# EAGLE design PI CONTROLER (EAGLE 7.6.0)
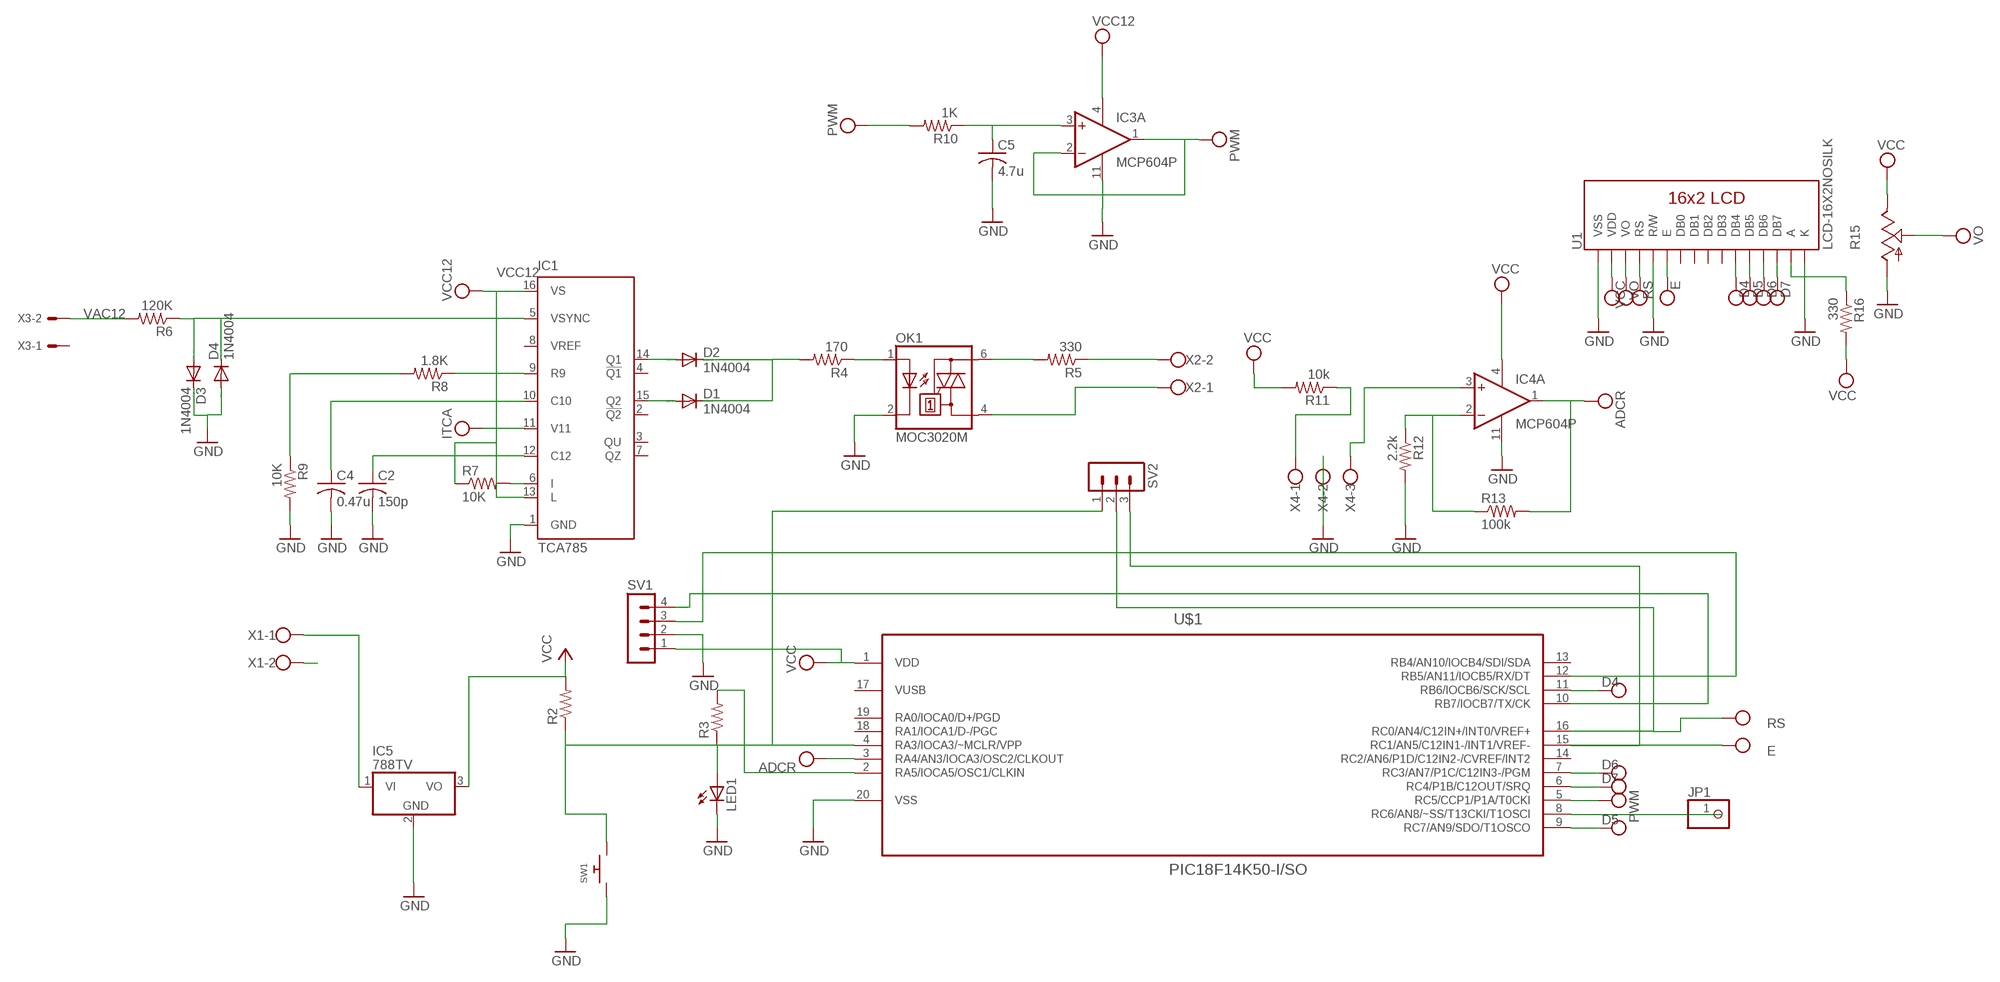
[diagram p0: schematic, sheet 1]

## Parts
C2  150p  C-US025-025X050  [C025-025X050]
C4  0.47u  C-US050-025X075  [C050-025X075]
C5  4.7u  C-US050-025X075  [C050-025X075]
D1  1N4004  [DO41-10]
D2  1N4004  [DO41-10]
D3  1N4004  [DO41-10]
D4  1N4004  [DO41-10]
IC1  TCA785  [DIL16]
IC3  MCP604P  [DIL14]
IC4  MCP604P  [DIL14]
IC5  788TV  [TO220V]
JP1  PINHD-1X1  [1X01]
LED1  LED5MM  [LED5MM]
OK1  MOC3020M  [DIL06]
R2  R-US_0207/10  [0207/10]
R3  R-US_0207/10  [0207/10]
R4  170  R-US_0207/10  [0207/10]
R5  330  R-US_0207/10  [0207/10]
R6  120K  R-US_0207/10  [0207/10]
R7  10K  R-US_0207/10  [0207/10]
R8  1.8K  R-US_0207/10  [0207/10]
R9  10K  R-US_0207/10  [0207/10]
R10  1K  R-US_0207/10  [0207/10]
R11  10k  R-US_0207/10  [0207/10]
R12  2.2k  R-US_0207/10  [0207/10]
R13  100k  R-US_0207/10  [0207/10]
R15  TRIM_US-RS3  [RS3]
R16  330  R-US_0207/10  [0207/10]
SV1  MA04-1  [MA04-1]
SV2  MA03-1  [MA03-1]
SW1  SWITCH_PUSHBUTTONEVQ-PE  [TACT_PANA-EVQ]
U1  LCD-16X2NOSILK  [LCD-16X2_NOSILK]
U$1  PIC18F14K50-I/SO  [SOIC127P1030X265-20N]
X1  W237-102  [W237-102]
X2  W237-102  [W237-102]
X3  KK-156-2  [KK-156-2]
X4  W237-103  [W237-103]

## Nets
ADCR: IC4.1(A:OUT) R13.2 U$1.3(RA4/AN3/IOCA3/OSC2/CLKOUT)
D4: U1.11(DB4) U$1.11(RB6/IOCB6/SCK/SCL)
D5: U1.12(DB5) U$1.9(RC7/AN9/SDO/T1OSCO)
D6: U1.13(DB6) U$1.7(RC3/AN7/P1C/C12IN3-/PGM)
D7: U1.14(DB7) U$1.6(RC4/P1B/C12OUT/SRQ)
D/: IC4.4(P:V+) IC5.3(VO) R2.2 R11.2 R15.E R16.2 SV1.1 U1.2(VDD) U$1.1(VDD) ; supply symbol labelled VCC
E: SV2.3 U1.6(E) U$1.15(RC1/AN5/C12IN1-/INT1/VREF-)
GND: C2.2 C4.2 C5.2 D3.C D4.A IC1.1(GND) IC3.11(P:V-) IC4.11(P:V-) IC5.2(GND) LED1.K(C) OK1.2(C) R9.2 R12.2 R15.A SV1.2 SW1.P$1 U1.1(VSS) U1.5(R/W) U1.16(K) U$1.20(VSS) X1.2 X4.2
ITCA: IC1.11(V11) IC3.1(A:OUT) IC3.2(A:-IN) ; supply symbol labelled PWM
N$1: R2.1 SV2.1 SW1.P$2 U$1.4(RA3/IOCA3/~MCLR/VPP)
N$2: R3.2 U$1.2(RA5/IOCA5/OSC1/CLKIN)
N$3: C2.1 IC1.12(C12)
N$5: SV1.4 U$1.10(RB7/IOCB7/TX/CK)
N$6: C4.1 IC1.10(C10)
N$9: D2.A IC1.14(Q1)
N$50: LED1.A R3.1
N$55: JP1.1 U$1.8(RC6/AN8/~SS/T13CKI/T1OSCI)
N$58: R5.1 X2.2
N$59: D1.A IC1.15(Q2)
N$60: D1.C D2.C R4.2
N$61: OK1.1(A) R4.1
N$62: OK1.6(A2) R5.2
N$63: OK1.4(A1) X2.1
N$64: D3.A D4.C IC1.5(VSYNC) R6.1
N$65: IC1.6(I) R7.2
N$66: IC1.9(R9) R8.1
N$67: R8.2 R9.1
N$68: C5.1 IC3.3(A:+IN) R10.1
N$69: R11.1 X4.1
N$70: IC4.3(A:+IN) X4.3
N$71: IC4.2(A:-IN) R12.1 R13.1
N$72: R16.1 U1.15(A)
N$78: SV1.3 U$1.12(RB5/AN11/IOCB5/RX/DT)
PWM: R10.2 U$1.5(RC5/CCP1/P1A/T0CKI)
RS: SV2.2 U1.4(RS) U$1.16(RC0/AN4/C12IN+/INT0/VREF+)
VAC12: R6.2 X3.2
VCC12: IC1.13(L) IC1.16(VS) IC3.4(P:V+) IC5.1(VI) R7.1 X1.1
VO: R15.S U1.3(VO)
Unconnected: IC1.2(!Q2) IC1.3(QU) IC1.4(!Q1) IC1.7(QZ) IC1.8(VREF) IC3.5(B:+IN) IC3.6(B:-IN) IC3.7(B:OUT) IC3.8(C:OUT) IC3.9(C:-IN) IC3.10(C:+IN) IC3.12(D:+IN) IC3.13(D:-IN) IC3.14(D:OUT) IC4.5(B:+IN) IC4.6(B:-IN) IC4.7(B:OUT) IC4.8(C:OUT) IC4.9(C:-IN) IC4.10(C:+IN) IC4.12(D:+IN) IC4.13(D:-IN) IC4.14(D:OUT) U1.7(DB0) U1.8(DB1) U1.9(DB2) U1.10(DB3) U$1.13(RB4/AN10/IOCB4/SDI/SDA) U$1.14(RC2/AN6/P1D/C12IN2-/CVREF/INT2) U$1.17(VUSB) U$1.18(RA1/IOCA1/D-/PGC) U$1.19(RA0/IOCA0/D+/PGD) X3.1

## Library data of the parts
C2 = adafruit:C-US: CAPACITOR, American symbol
C4 C5 = resistor:C-US: CAPACITOR, American symbol
D1-D4 = diode:1N4004: DIODE general purpose rectifier, 1 A
IC1 = infineon:TCA785: Phase Control IC Source: http://www.infineon.com/ .. tca785.pdf; OC_FARNELL: unknown; OC_NEWARK: unknown
IC3 IC4 = linear:MCP604: Quad Op Amp 2.7V to 6.0V Single Supply CMOS Source: http://ww1.microchip.com/downloads/en/DeviceDoc/21314g.pdf
IC5 = linear:78*: Positive VOLTAGE REGULATOR Source: http://cache.national.com/ds/LM/LM78L05.pdf http://www.fairchildsemi.com/ds/LM/LM7805.pdf
JP1 = adafruit:PINHD-1X1: Pin header 1x1 for 0.1" spacing With round pins
LED1 = adafruit:LED: LED OSRAM: - CHIPLED LG R971, LG N971, LY N971, LG Q971, LY Q971, LO R971, LY R971 LH N974, LH R974 LS Q976, LO Q976, LY Q976 LO Q996 - Hyper CHIPLED LW Q18S LB Q993, LB Q99A, LB R99A - SideLED LS A670, LO A670, LY A670, LG A670, LP A670 LB A673, LV A673, LT A673, LW A673 LH A674 LY A675 LS A676, LA A676, LO A676, LY A676, LW A676 LS A679, LY A679, LG A679 - Hyper Micro SIDELED® LS Y876, LA Y876, LO Y876, LY Y876 LT Y87S - SmartLED LW L88C, LW L88S LB L89C, LB L89S, LG L890 LS L89K, LO L89K, LY L89K LS L896, LA L896, LO L896, LY L896 - TOPLED LS T670, LO T670, LY T670, LG T670, LP T670 LSG T670, LSP T670, LSY T670, LOP T670, LYG T670 LG T671, LOG T671, LSG T671 LB T673, LV T673, LT T673, LW T673 LH T674 LS T676, LA T676, LO T676, LY T676, LB T676, LH T676, LSB T676, LW T676 LB T67C, LV T67C, LT T67C, LS T67K, LO T67K, LY T67K, LW E67C LS E67B, LA E67B, LO E67B, LY E67B, LB E67C, LV E67C, LT E67C LW T67C LS T679, LY T679, LG T679 LS T770, LO T770, LY T770, LG T770, LP T770 LB T773, LV T773, LT T773, LW T773 LH T774 LS E675, LA E675, LY E675, LS T675 LS T776, LA T776, LO T776, LY T776, LB T776 LHGB T686 LT T68C, LB T68C - Hyper Mini TOPLED® LB M676 - Mini TOPLED Santana® LG M470 LS M47K, LO M47K, LY M47K Source: http://www.osram.convergy.de/
OK1 = optocoupler:MOC30*M: RANDOM-PHASE OPTOISOLATORS TRIAC DRIVER OUTPUT Source: http://www.fairchildsemi.com MOC3020-M.pdf; MF: FAIRCHILD SEMICONDUCTOR; MPN: MOC3020-M; OC_FARNELL: 1505425; OC_NEWARK: 72K8895
R2-R13 R16 = resistor:R-US_: RESISTOR, American symbol
R15 = pot:TRIM_US-: POTENTIOMETER
SV1 = con-lstb:MA04-1: PIN HEADER; OC_FARNELL: unknown; OC_NEWARK: unknown
SV2 = con-lstb:MA03-1: PIN HEADER; OC_FARNELL: unknown; OC_NEWARK: unknown
SW1 = adafruit:SWITCH_PUSHBUTTON: Buttons SOFTTOUCHSMD_SJ - Soft touch temporary push button (Super Junk Akihabara) Compatible with SKPMANE010 [Mouser: 688-SKPMAN] C&K_KSS = Digikey: KSS221GLFS
U1 = SparkFun-Displays:LCD-16X2: Standard text-only 16x2 parallel input LCD
U$1 = Microchip_By_element14_Batch_1:PIC18F14K50-I/SO: USB Flash Microcontrollers; DESCRIPTION: Microcontrollers; MPN: PIC18F14K50-I/SO; OC_FARNELL: 1648502; OC_NEWARK: 77M3104; PACKAGE: SOIC-20; SUPPLIER: Microchip
X1 X2 = con-wago-500:W237-102: WAGO SCREW CLAMP; MPN: 237-102; OC_FARNELL: unknown; OC_NEWARK: 70K9898
X3 = con-molex:KK-156-2: KK 156 HEADER Source: http://www.molex.com/pdm_docs/sd/026604100_sd.pdf; OC_FARNELL: unknown; OC_NEWARK: unknown
X4 = con-wago-500:W237-103: WAGO SCREW CLAMP; MPN: 237-103; OC_FARNELL: unknown; OC_NEWARK: 18M7116

## Board
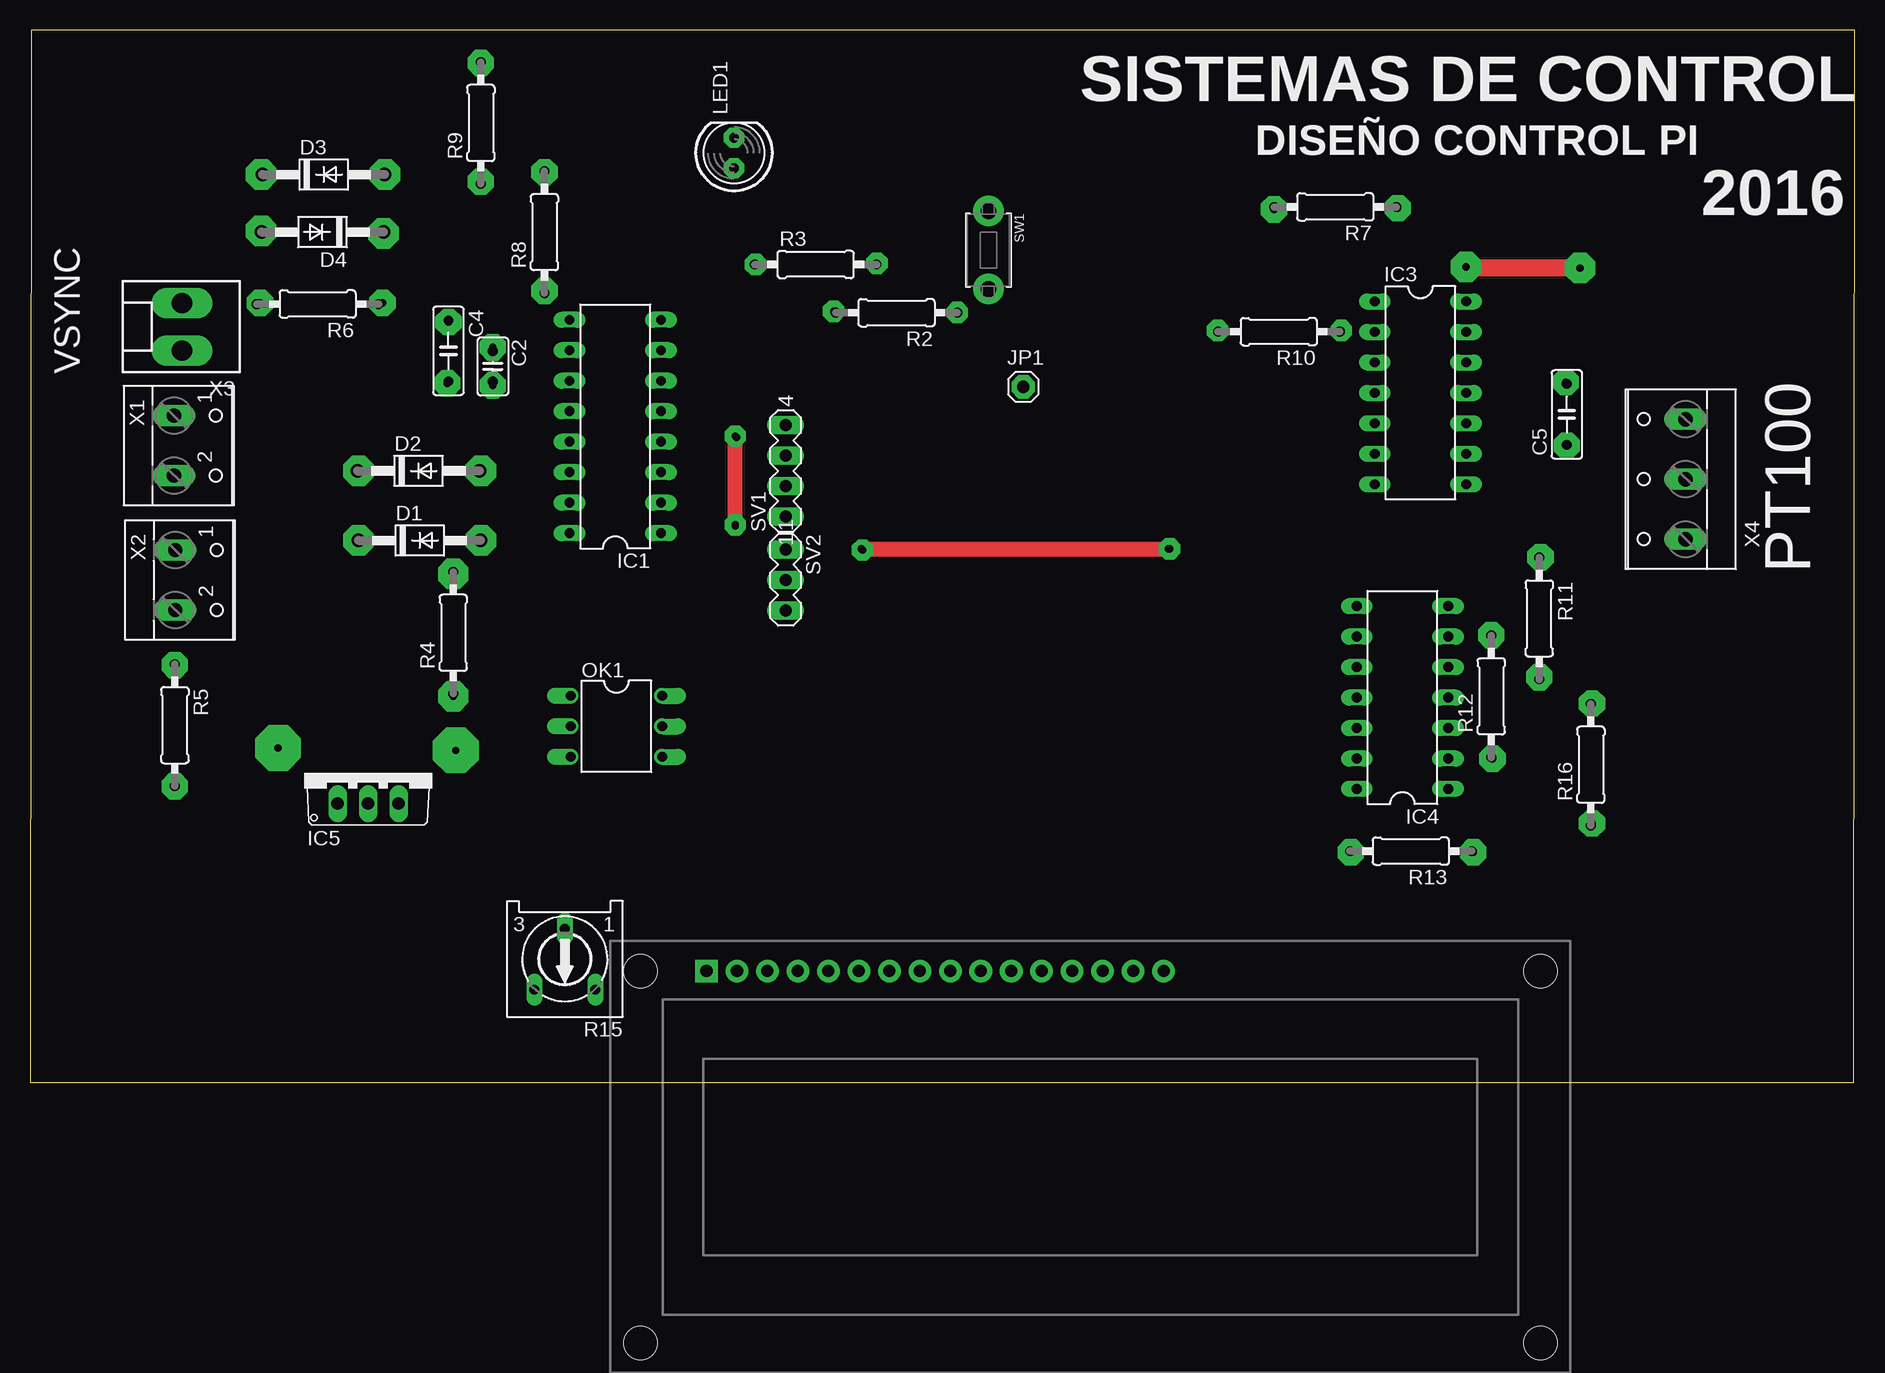
[diagram p1: board, top side]
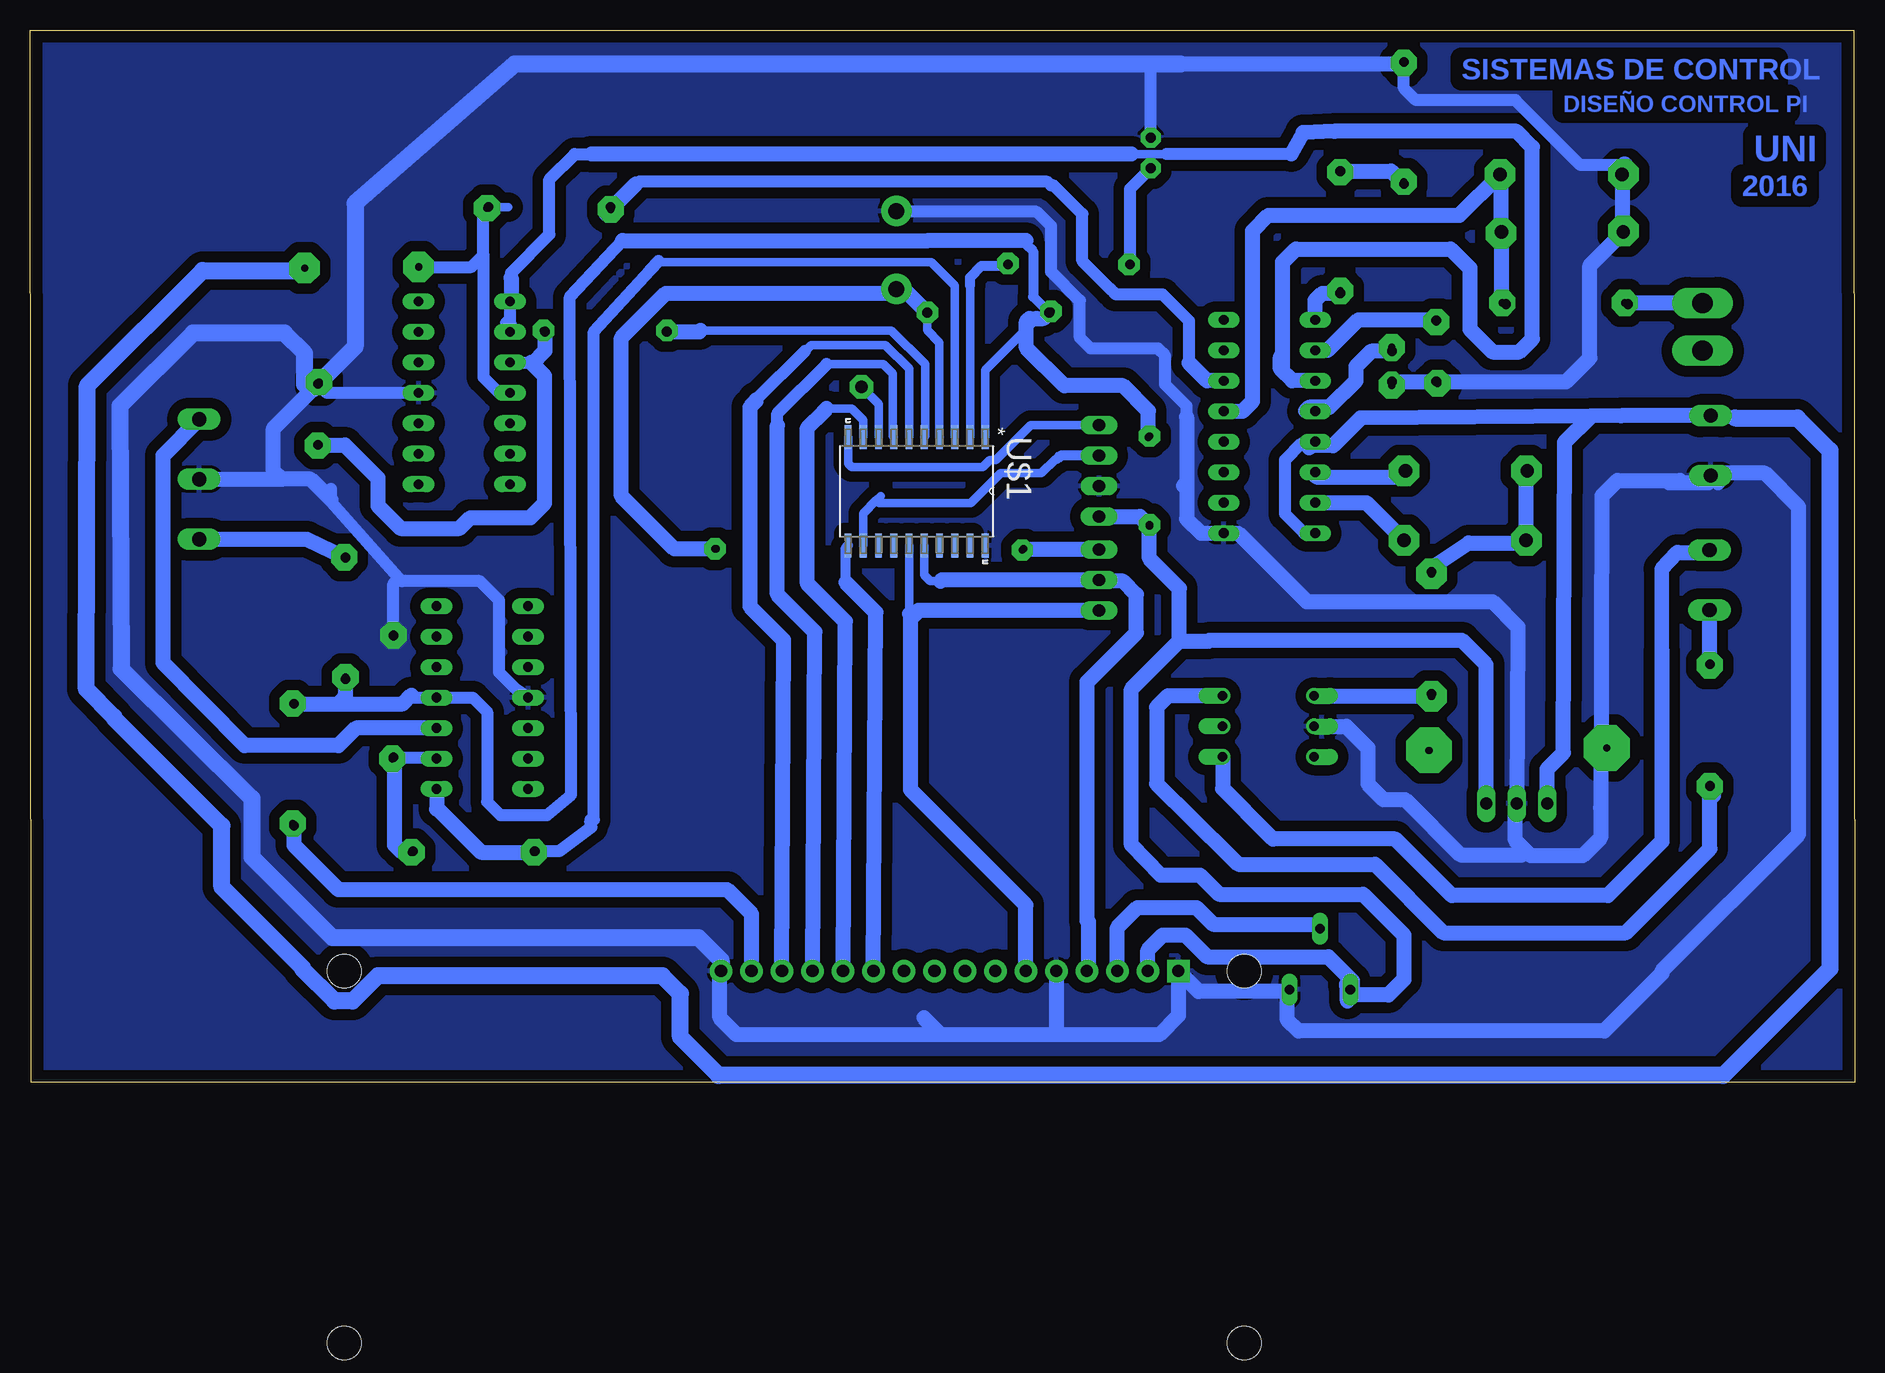
[diagram p2: board, bottom side, seen from below]

Size 152.06 x 87.73 mm. Coordinates in mm from the lower left corner, seen from the top.
Outline: 0,0 151.96,0 152.06,87.73 0.1,87.73 0,0
Copper layers (1*16): Top 0.035mm / dielectric 1.5mm / Bottom 0.035mm
Design rules "default *": minimum track width 10mil, minimum drill 24mil, track to track 35mil, track to pad 30mil, pad to pad 30mil, via to via 30mil, smd to smd 30mil, copper to edge 40mil, drill to drill 8mil, minimum pad ring 10mil, minimum via ring 8mil, stop-mask expansion 4mil, vias tented up to drill 0mil, thermal gap 10mil

### Footprints (pad centres in the part's own frame; a part is rotated, then mirrored left to right if it is on the bottom)
C025-025X050 = drill 0.813 pad 1.676 octagon: 1 -1.27,0; 2 1.27,0
C050-025X075 = drill 0.813 octagon: 1 -2.54,0; 2 2.54,0
DO41-10 = drill 1.118: A 5.08,0; C -5.08,0
DIL16 = drill 0.813 long: 1 -8.89,-3.81; 2 -6.35,-3.81; 3 -3.81,-3.81; 4 -1.27,-3.81; 5 1.27,-3.81; 6 3.81,-3.81; 7 6.35,-3.81; 8 8.89,-3.81; 9 8.89,3.81; 10 6.35,3.81; 11 3.81,3.81; 12 1.27,3.81; 13 -1.27,3.81; 14 -3.81,3.81; 15 -6.35,3.81; 16 -8.89,3.81
DIL14 = drill 0.813 long: 1 -7.62,-3.81; 2 -5.08,-3.81; 3 -2.54,-3.81; 4 0,-3.81; 5 2.54,-3.81; 6 5.08,-3.81; 7 7.62,-3.81; 8 7.62,3.81; 9 5.08,3.81; 10 2.54,3.81; 11 0,3.81; 12 -2.54,3.81; 13 -5.08,3.81; 14 -7.62,3.81
TO220V = drill 1.016 long: 1 -2.54,-2.54; 2 0,-2.54; 3 2.54,-2.54
1X01 = drill 1.016 pad 1.93 octagon: 1 0,0
LED5MM = drill 0.813 pad 1.676 octagon: A -1.27,0; K 1.27,0
DIL06 = drill 0.813 offset: 1 -2.54,-3.81; 2 0,-3.81; 3 2.54,-3.81; 4 2.54,3.81; 5 0,3.81; 6 -2.54,3.81
0207/10 = drill 0.813 octagon: 1 -5.08,0; 2 5.08,0
RS3 = drill 0.813 long: A -2.54,2.54; E 2.54,2.54; S 0,-2.54
MA04-1 = drill 1.016 long: 1 -3.81,0; 2 -1.27,0; 3 1.27,0; 4 3.81,0
MA03-1 = drill 1.016 long: 1 -2.54,0; 2 0,0; 3 2.54,0
TACT_PANA-EVQ = drill 1.3 pad 2.54: P$1 -3.25,0; P$2 3.25,0
LCD-16X2_NOSILK = drill 1.016 pad 1.88 square: 1 -32,15.5 | drill 1.016 pad 1.88: 2 -29.46,15.5; 3 -26.92,15.5; 4 -24.38,15.5; 5 -21.84,15.5; 6 -19.3,15.5; 7 -16.76,15.5; 8 -14.22,15.5; 9 -11.68,15.5; 10 -9.14,15.5; 11 -6.6,15.5; 12 -4.06,15.5; 13 -1.52,15.5; 14 1.02,15.5; 15 3.56,15.5; 16 6.1,15.5 | hole 2.8: -37.5,15.5; -37.5,-15.5; 37.5,15.5; 37.5,-15.5
SOIC127P1030X265-20N = smd 1.981 x 0.559: 1 -4.521,5.715; 2 -4.521,4.445; 3 -4.521,3.175; 4 -4.521,1.905; 5 -4.521,0.635; 6 -4.521,-0.635; 7 -4.521,-1.905; 8 -4.521,-3.175; 9 -4.521,-4.445; 10 -4.521,-5.715; 11 4.521,-5.715; 12 4.521,-4.445; 13 4.521,-3.175; 14 4.521,-1.905; 15 4.521,-0.635; 16 4.521,0.635; 17 4.521,1.905; 18 4.521,3.175; 19 4.521,4.445; 20 4.521,5.715
W237-102 = drill 1.194 long: 1 -2.5,-1.27; 2 2.5,-1.27
KK-156-2 = drill 1.7 pad 2.184 long: 1 -1.98,0; 2 1.98,0
W237-103 = drill 1.194 long: 1 -5,-1.29; 2 0,-1.29; 3 5,-1.29

### Placement (x,y rotation side)
C2  38.57,59.68 270 top
C4  34.87,60.98 270 top
C5  128.07,55.68 90 top
D1  32.47,45.18 0 top
D2  32.37,50.98 0 top
D3  24.47,75.68 0 top
D4  24.37,70.88 180 top
IC1  48.77,54.68 90 top
IC3  115.87,57.48 270 top
IC4  114.37,32.08 90 top
IC5  28.17,25.78 0 top
JP1  82.77,57.98 0 top
LED1  58.67,77.48 90 top
OK1  48.87,29.68 270 top
R2  72.21,64.16 180 top
R3  65.47,68.18 0 top
R4  35.27,37.48 90 top
R5  12.07,29.78 270 top
R6  23.97,64.88 180 top
R7  108.77,72.98 180 top
R8  42.87,70.88 90 top
R9  37.57,79.98 90 top
R10  104.07,62.58 180 top
R11  125.77,38.68 270 top
R12  121.77,32.18 90 top
R13  115.07,19.28 180 top
R15  44.57,10.28 180 top
R16  130.07,26.48 90 top
SV1  62.97,50.98 90 top
SV2  62.97,41.88 270 top
SW1  79.87,69.38 270 top
U1  88.37,-6.22 0 top
U$1  78.17,49.28 270 bottom
X1  13.27,53.08 270 top
X2  13.37,41.88 270 top
X3  12.67,62.98 90 top
X4  136.67,50.28 90 top

### Tracks (layer width: path | path; a pad name or v marks a point on that pad's centre or on a via)
ADCR
  Bottom 0.7: U$1.3 75,66.41 76.97,68.38 99.71,68.38 100.33,67.75
  Bottom 1.016: R13.2 107.97,19.28 105.27,21.28 105.37,21.88 105.07,21.88 105.07,62.58 100.33,67.75 99.67,68.48
  Bottom 1.27: IC4.1 118.18,22.79 118.08,22.79 114.47,19.18 110.09,19.18 R13.2
D4
  Bottom 0.813: 84.07,41.68 84.07,44.57 U$1.11
  Bottom 1.27: U1.11 81.57,39.18 84.07,41.68
D5
  Bottom 0.7: U$1.9 82.61,55.23 83.57,56.18 85.67,56.18
  Bottom 1.27: U1.12 84.11,38.42 87.27,41.58 87.27,54.58 85.92,55.93 85.67,56.18
D6
  Bottom 0.7: 85.67,59.88 80.97,59.88 80.17,59.08 80.17,53.9 U$1.7
  Bottom 1.016: 89.77,54.78 89.77,55.78 85.67,59.88
  Bottom 1.27: U1.13 86.65,37.56 89.77,40.68 89.77,54.78
D7
  Bottom 0.7: U$1.6 78.81,59.52 80.77,61.48 86.97,61.48 87.47,60.98
  Bottom 1.016: 87.47,60.98 91.57,56.88
  Bottom 1.27: 91.57,56.88 91.57,56.78 92.07,56.28 92.07,39.68 89.27,36.88 89.47,9.36 U1.14
D/  (via drill 0.6, 0.6 pad 1.78)
  Top 1.27: v58.77,46.38 v58.77,46.48 58.77,53.68 v58.87,53.78
  Bottom 0.7: U$1.1 72.45,59.39 68.17,63.68 | 68.87,70.19 69.06,70.19 | R2.2 66.69,64.16 66.57,64.28
  Bottom 0.813: 69.06,70.19 69.06,69.87 68.47,69.28 68.47,65.5 R2.2
  Bottom 1.016: 120.27,32.28 120.07,32.08 IC4.4 115.17,32.08 113.97,30.88 113.97,23.38 112.87,22.28 108.97,22.28 106.97,23.98 107.07,65.48 102.67,70.18
  Bottom 1.27: U1.2 58.91,11.04 57.67,12.28 55.77,12.28 53.97,10.48 43.87,10.48 41.87,8.48 41.87,7.9 R15.E 42.37,8.08 42.37,8.18 42.27,8.08 42.27,6.78 41.77,7.28 38.87,7.28 37.57,8.58 37.57,12.28 40.97,15.68 52.97,15.68 54.57,17.28 57.87,17.28 60.27,19.78 60.27,32.78 56.27,36.78 | 69.06,70.19 77.17,70.18 102.67,70.18 | R16.2 126.37,31.56 | 126.37,31.56 120.99,31.56 120.27,32.28 | R11.2 125.77,32.28 125.87,32.18 125.87,32.06 126.37,31.56 | 56.27,36.78 53.85,36.78 53.77,36.87 32.76,36.87 30.71,34.82 IC5.3 | SV1.1 59.57,47.18 v58.77,46.38 58.77,43.68 56.27,41.18 56.27,36.78 | v58.87,53.78 58.87,55.98 60.97,58.08 65.87,58.08 69.02,61.23 69.02,63.43 68.77,63.68 68.17,63.68 67.61,63.68 R2.2
E
  Bottom 0.7: 78.77,39.08 78.77,44.72 U$1.15
  Bottom 1.27: U1.6 69.07,14.78 78.67,24.38 78.67,38.68 | 78.67,38.68 78.67,38.98 78.77,39.08 | SV2.3 78.01,39.34 78.67,38.68
GND  (via drill 0.6 pad 2.18)
  Bottom 1.016: IC3.11 127.33,57.48 C5.2 128.11,58.18 129.17,58.18 | IC4.11 111.57,32.78 112.97,34.18 112.97,40.18 114.57,41.78 121.07,41.78 121.32,42.03 | 121.32,42.03 126.97,48.38 126.97,48.58 126.97,49.48 | R12.2 v121.77,37.28 121.77,41.58 121.32,42.03 | 19.17,76.48 22.87,76.48 28.27,81.88 36.57,81.88 37.57,82.88 37.57,84.48 37.47,84.58 | SW1.P$1 79.82,72.58 68.17,72.58 66.97,71.38 66.97,67.58 64.57,65.18 64.57,62.08 63.67,61.18 58.07,61.18 57.47,60.58 57.47,58.18 55.67,56.38 55.67,55.48 | LED1.K 58.67,84.78 58.77,84.88
  Bottom 1.27: D3.C 19.39,75.18 | 19.39,75.18 19.39,70.98 D4.A 22.07,68.1 22.07,60.38 24.04,58.41 34.9,58.41 | 12.57,50.38 12.17,49.98 14.37,49.98 | 12.57,50.38 12.2,50.38 X1.2 11.4,49.98 | 28.07,23.14 IC5.2 | 14.37,49.98 15.47,49.98 | 19.17,76.28 19.17,75.4 19.39,75.18 | 12.57,50.38 12.17,50.78 7.47,50.78 4.67,47.98 4.67,20.68 16.07,9.28 16.07,9.08 20.87,4.28 46.37,4.28 47.27,5.18 47.27,7.58 | 47.27,7.58 R15.A | 47.27,7.58 54.67,7.58 U1.1 56.37,5.58 57.97,3.98 66.77,3.98 | 66.77,3.98 76.17,3.98 | 76.17,3.98 93.17,3.98 94.57,5.38 94.57,9.18 U1.16 | U1.5 66.53,4.22 66.77,3.98 | 77.57,5.38 76.17,3.98 | R9.2 37.47,84.96 37.47,84.58 37.77,84.88 56.2,84.88 | C2.2 34.9,58.41 | 34.9,58.41 C4.2 | IC5.2 28.07,37.98 30.17,40.08 45.67,40.08 51.38,45.79 IC1.1 54.47,45.78 55.67,46.98 55.67,49.98 | X4.2 131.07,50.28 | 126.97,48.58 128.67,50.28 131.07,50.28 | 131.07,50.28 131.77,50.98 131.77,54.52 128.49,57.8 C5.2 | 14.37,49.98 14.57,50.18 19.77,50.18 21.07,48.88 21.17,22.88 21.17,20.38 22.67,18.88 26.97,18.88 27.27,19.18 | 55.67,55.48 55.67,49.98 | 55.94,49.71 55.67,49.98 | 27.27,19.18 28.27,20.18 28.27,23.14 IC5.2 | OK1.2 42.37,29.68 40.57,27.88 40.57,24.88 39.27,23.58 37.47,23.58 32.87,18.98 27.67,18.98 27.27,19.18
  Bottom 1.422: 129.17,58.18 129.17,60.78 130.87,62.48 138.47,62.48 144.57,56.38 144.47,34.48 133.57,23.68 133.57,18.78 126.87,12.08 96.37,12.08 94.47,10.18 U1.16 | 56.2,84.88 58.77,84.88 111.67,84.88 124.97,73.28 124.97,61.32 128.49,57.8 | 19.17,76.28 19.17,76.48
  pour Bottom: 0.1,87.76 -0.1,-0.6 152.68,-0.3 152.88,88.06
ITCA
  Bottom 0.7: 57.37,77.38 60.27,77.38
  Bottom 1.016: IC3.2 IC3.1 | 111.97,67.08 111.97,67.48 108.77,70.68 108.77,75.28 106.67,77.38 105.27,77.38 104.37,77.38 | 46.97,77.38 57.37,77.38
  Bottom 1.2: 45.97,79.18 46.97,77.38
  Bottom 1.27: IC1.11 46.88,58.49 47.87,59.48 47.87,60.48 47.67,60.68 | 47.67,59.48 47.67,60.68 | 47.67,60.68 47.67,68.38 46.57,69.48 33.67,69.48 32.07,67.88 32.07,62.78 30.17,60.88 27.97,60.88 26.87,61.98 26.87,77.98 28.17,79.28 43.37,79.28 45.97,79.18 | 111.97,67.08 111.97,65.19 IC3.1 | IC3.2 112.06,63.07 112.07,63.08 | 112.27,63.28 112.07,63.08 | 112.07,63.08 112.17,63.08 | 60.27,77.38 105.27,77.38
N$1  (via drill 0.6, 0.6 pad 1.78)
  Top 1.27: v69.27,44.48 v94.87,44.48
  Bottom 0.7: R2.1 77.29,62.7 76.27,61.68 U$1.4
  Bottom 1.27: R2.1 79.26,66.13 SW1.P$2 80.22,65.78 99.07,65.78 102.77,62.08 102.77,48.88 98.37,44.48 v94.97,44.48 v94.87,44.48 | SV2.1 69.21,44.42 v69.27,44.48
N$2
  Bottom 0.7: U$1.2 73.72,66.44
  Bottom 0.813: 73.72,66.44 73.72,67.12 72.77,68.08 70.65,68.08 R3.2
N$3
  Bottom 1.27: IC1.12 44.99,55.98 45.77,55.98 45.47,56.28 43.77,56.28 41.57,58.48 41.57,59.68 40.3,60.95 C2.1
N$4  (via drill 0.6 pad 2.54)
  other vias: 19.27,75.68
N$5
  Bottom 0.7: U$1.10 83.88,51.59 83.57,51.28 72.67,51.28 72.07,51.88 71.57,51.88 68.67,54.78 SV1.4
N$6
  Bottom 1.27: IC1.10 43.92,61.03 41.37,63.58 34.93,63.58 C4.1
N$7  (via drill 0.6 pad 2.54)
  other vias: 29.57,75.68
N$8  (via drill 0.6 pad 2.54)
  other vias: 19.27,70.98
N$9
  Bottom 1.27: IC1.14 44.96,50.57 44.87,50.48 37.95,50.48 D2.A
N$10  (via drill 0.6 pad 2.54)
  other vias: 29.47,70.78
N$11  (via drill 0.6 pad 2.54)
  other vias: 27.37,45.18
N$12  (via drill 0.6 pad 2.54)
  other vias: 27.37,50.98
N$13  (via drill 0.6 pad 2.54)
  other vias: 37.57,50.98
N$14  (via drill 0.6 pad 2.54)
  other vias: 37.57,45.18
N$15  (via drill 0.6 pad 2.54)
  other vias: 35.27,42.38
N$16  (via drill 0.6 pad 2.54)
  other vias: 35.27,32.18
N$18  (via drill 0.6 pad 1.78)
  other vias: 58.77,53.88
N$24
  pour Bottom: -0.03,87.98 -0.23,-0.42 152.17,0.08 152.37,88.48
N$27  (via drill 0.6 pad 2.18)
  other vias: 125.87,43.78
N$28  (via drill 0.6 pad 2.18)
  other vias: 121.87,26.98
N$29  (via drill 0.6 pad 2.18)
  other vias: 120.27,19.18
N$30  (via drill 0.6 pad 2.18)
  other vias: 110.07,19.18
N$31  (via drill 0.6 pad 2.18)
  other vias: 130.17,21.58
N$32  (via drill 0.6 pad 2.18)
  other vias: 130.17,31.58
N$35  (via drill 0.6 pad 2.18)
  other vias: 125.77,33.78
N$36  (via drill 0.6 pad 2.18)
  other vias: 127.97,58.38
N$37  (via drill 0.6 pad 2.18)
  other vias: 128.07,53.08
N$40  (via drill 0.6 pad 2.18)
  other vias: 103.67,72.78
N$41  (via drill 0.6 pad 2.18)
  other vias: 113.97,72.88
N$42  (via drill 0.6 pad 2.18)
  other vias: 37.57,75.08
N$43  (via drill 0.6 pad 2.18)
  other vias: 37.57,84.98
N$44  (via drill 0.6 pad 2.18)
  other vias: 29.37,64.98
N$45  (via drill 0.6 pad 2.18)
  other vias: 19.17,64.98
N$46  (via drill 0.6 pad 2.18)
  other vias: 12.07,34.78
N$47  (via drill 0.6 pad 2.18)
  other vias: 12.07,24.68
N$48  (via drill 0.6 pad 2.18)
  other vias: 34.87,63.38
N$49  (via drill 0.6 pad 2.18)
  other vias: 34.77,58.28
N$50
  Bottom 1.016: R3.1 60.39,74.49 LED1.A
N$51  (via drill 0.6 pad 2.18)
  other vias: 38.57,61.28
N$52  (via drill 0.6 pad 2.18)
  other vias: 38.57,58.08
N$53  (via drill 0.6 pad 2.18)
  other vias: 42.87,75.88
N$54  (via drill 0.6 pad 2.18)
  other vias: 42.87,65.98
N$55
  Bottom 0.7: U$1.8 81.34,56.55 JP1.1
N$56  (via drill 0.6 pad 1.78)
  other vias: 69.37,44.38
N$58
  Bottom 1.27: R5.1 12.07,39.35 X2.2
N$59
  Bottom 1.27: IC1.15 40.7,48.33 D1.A
N$60
  Bottom 1.27: D2.C 27.39,50.88 D1.C 27.59,44.98 32.17,44.98 35.27,42.88 R4.2
N$61
  Bottom 1.27: OK1.1 35.45,32.22 R4.1
N$62
  Bottom 1.27: OK1.6 57.23,32.22 58.17,31.28 58.17,24.88 52.07,18.88 51.37,18.18 39.97,18.18 34.27,12.48 19.07,12.48 12.07,19.48 R5.2 11.77,24.4 11.77,23.88
N$63
  Bottom 1.2: 16.07,35.98 16.07,42.78
  Bottom 1.27: OK1.4 52.68,24.49 48.87,20.68 48.57,20.38 48.47,20.28 38.27,20.28 33.57,15.58 20.57,15.58 16.07,20.08 16.07,35.98 | 16.07,42.78 14.77,44.18 12.3,44.18 X2.1
N$64
  Bottom 1.27: 29.45,71.48 D4.C 29.45,65.28 R6.1 | 29.45,71.48 29.45,75.58 D3.A 32.95,72.28 48.87,72.28 50.17,70.98 50.17,56.78 51,55.95 IC1.5 | 30.05,70.88 29.45,71.48
N$65
  Bottom 1.016: 101.57,74.88 101.37,75.08 67.27,75.08 66.97,74.78 66.77,74.78 64.37,72.38 64.37,68.48 62.02,66.13 61.67,65.78 61.57,65.68 57.67,65.68 55.47,63.48 55.47,59.98
  Bottom 1.27: IC1.6 53.98,58.49 55.47,59.98 | 101.57,74.88 104.07,72.38 104.07,72.6 R7.2
N$66
  Bottom 1.27: IC1.9 44.96,65.19 44.37,65.78 42.89,65.78 R8.1
N$67
  Bottom 1.27: R8.2 38.63,75.96 R9.1
N$68
  Bottom 1.016: IC3.3 110.31,60.02
  Bottom 1.27: 110.22,59.93 109.17,58.88 109.17,48.28 110.37,47.08 115.37,47.08 116.27,46.18 121.17,46.18 123.07,48.08 123.07,50.38 125.83,53.14 C5.1 | 110.22,59.93 110.31,60.02 | R10.1 109.15,61 110.22,59.93
N$69
  Bottom 1.27: X4.1 128.99,45.28 R11.1
N$70
  Bottom 1.27: IC4.3 124.91,29.54 126.37,28.08 134.17,28.08 140.97,34.98 140.97,52.27 X4.3
N$71
  Bottom 1.016: R12.1 118.28,27.1 IC4.2
  Bottom 1.27: R13.1 121.17,19.28 121.67,19.78 121.67,27 R12.1
N$72
  Bottom 1.27: U1.15 91.93,14.04 93.97,16.08 126.37,16.08 130.07,19.78 R16.1
N$73  (via drill 0.6 pad 1.78)
  other vias: 98.97,62.68
N$75  (via drill 0.6 pad 1.78)
  other vias: 109.27,62.68
N$76  (via drill 0.6 pad 1.78)
  other vias: 66.97,64.28
N$77  (via drill 0.6 pad 1.78)
  other vias: 77.27,64.18
N$78
  Bottom 0.7: U$1.12 82.61,47.44 81.52,48.53 | 81.52,48.53 81.17,48.88 | 66.47,51.98 66.57,51.98 67.77,50.78 71.17,50.78 73.67,48.28 81.27,48.28 81.52,48.53
  Bottom 0.813: SV1.3 66.2,52.25 66.47,51.98
N$80  (via drill 0.6 pad 1.78)
  other vias: 60.47,68.18
N$81  (via drill 0.6 pad 1.78)
  other vias: 70.57,68.28
N$86  (via drill 0.6 pad 3.81)
  other vias: 35.47,27.68
N$87  (via drill 0.6 pad 3.81)
  other vias: 20.67,27.88
PWM
  Bottom 0.7: 96.37,62.68 96.17,62.68 80.27,62.68 77.47,59.88 77.47,53.87 U$1.5
  Bottom 1.27: R10.2 96.27,62.58 96.17,62.68
RS
  Bottom 0.7: U$1.16 77.53,42.28 77.03,41.78 76.17,41.78
  Bottom 1.27: U1.4 63.87,9.4 63.87,13.38 63.97,13.48 63.97,33.38 59.87,37.48 59.87,40.68 60.97,41.78 62.87,41.78 SV2.2 76.07,41.88 76.17,41.78
VAC12
  Bottom 1.27: X3.2 19.21,64.96 R6.2
VCC12  (via drill 0.6 pad 2.54)
  Top 1.422: v129.17,67.88 119.77,67.88 v119.67,67.98
  Bottom 0.7: R7.1 112.2,72.98
  Bottom 1.016: IC1.16 45.88,45.79 47.47,47.38 47.47,51.88 46.07,53.28 45.89,53.28 45.49,52.88 | 9.97,55.38 11.8,55.38 X1.1 | 114.27,68.98 114.27,58.78 113.07,57.58 112.16,57.58 IC3.4 | v119.67,67.98 115.27,67.98 114.27,68.98 | 114.27,68.98 114.27,72.56 R7.1
  Bottom 1.27: 45.49,52.88 45.29,53.08 | 45.29,53.08 IC1.13 | X1.1 19.47,55.58 21.97,55.56 | 21.97,55.56 41.17,55.38 43.47,53.08 45.29,53.08 | IC5.1 25.63,26.12 24.27,27.48 24.17,53.36 21.97,55.56
  Bottom 1.422: 9.97,55.38 4.77,55.38 2.07,52.68 2.07,9.48 10.97,0.58 94.67,0.58 97.87,3.78 97.87,7.38 99.37,8.88 123.07,8.88 125.17,6.78 126.67,6.78 129.37,9.48 129.37,9.58 136.07,16.28 136.07,21.38 145.07,30.38 145.07,30.48 147.37,32.78 147.27,58.08 137.67,67.68 129.37,67.68 v129.17,67.88
VO
  Bottom 1.27: U1.3 61.45,12.9 59.77,14.58 54.87,14.58 53.47,13.18 44.93,13.18 R15.S

### Text on the board
Bottom: SISTEMAS DE CONTROL | DISEÑO CONTROL PI | UNI | 2016
tNames: SISTEMAS DE CONTROL | DISEÑO CONTROL PI | 2016 | VSYNC | PT100